# EasyEDA Pro project ProPrj_初级项目_2026-01-11.epro, schematic Schematic1

## Sheets
1 信号: Board Name: Board1; Create Date: 2025-09-25; Page Name: 信号; Project Name: 初级项目; Schematic Name: Schematic1; Update Date: 2025-11-07; Company: 嘉立创EDA; Page Size: A4; Version: V1.0
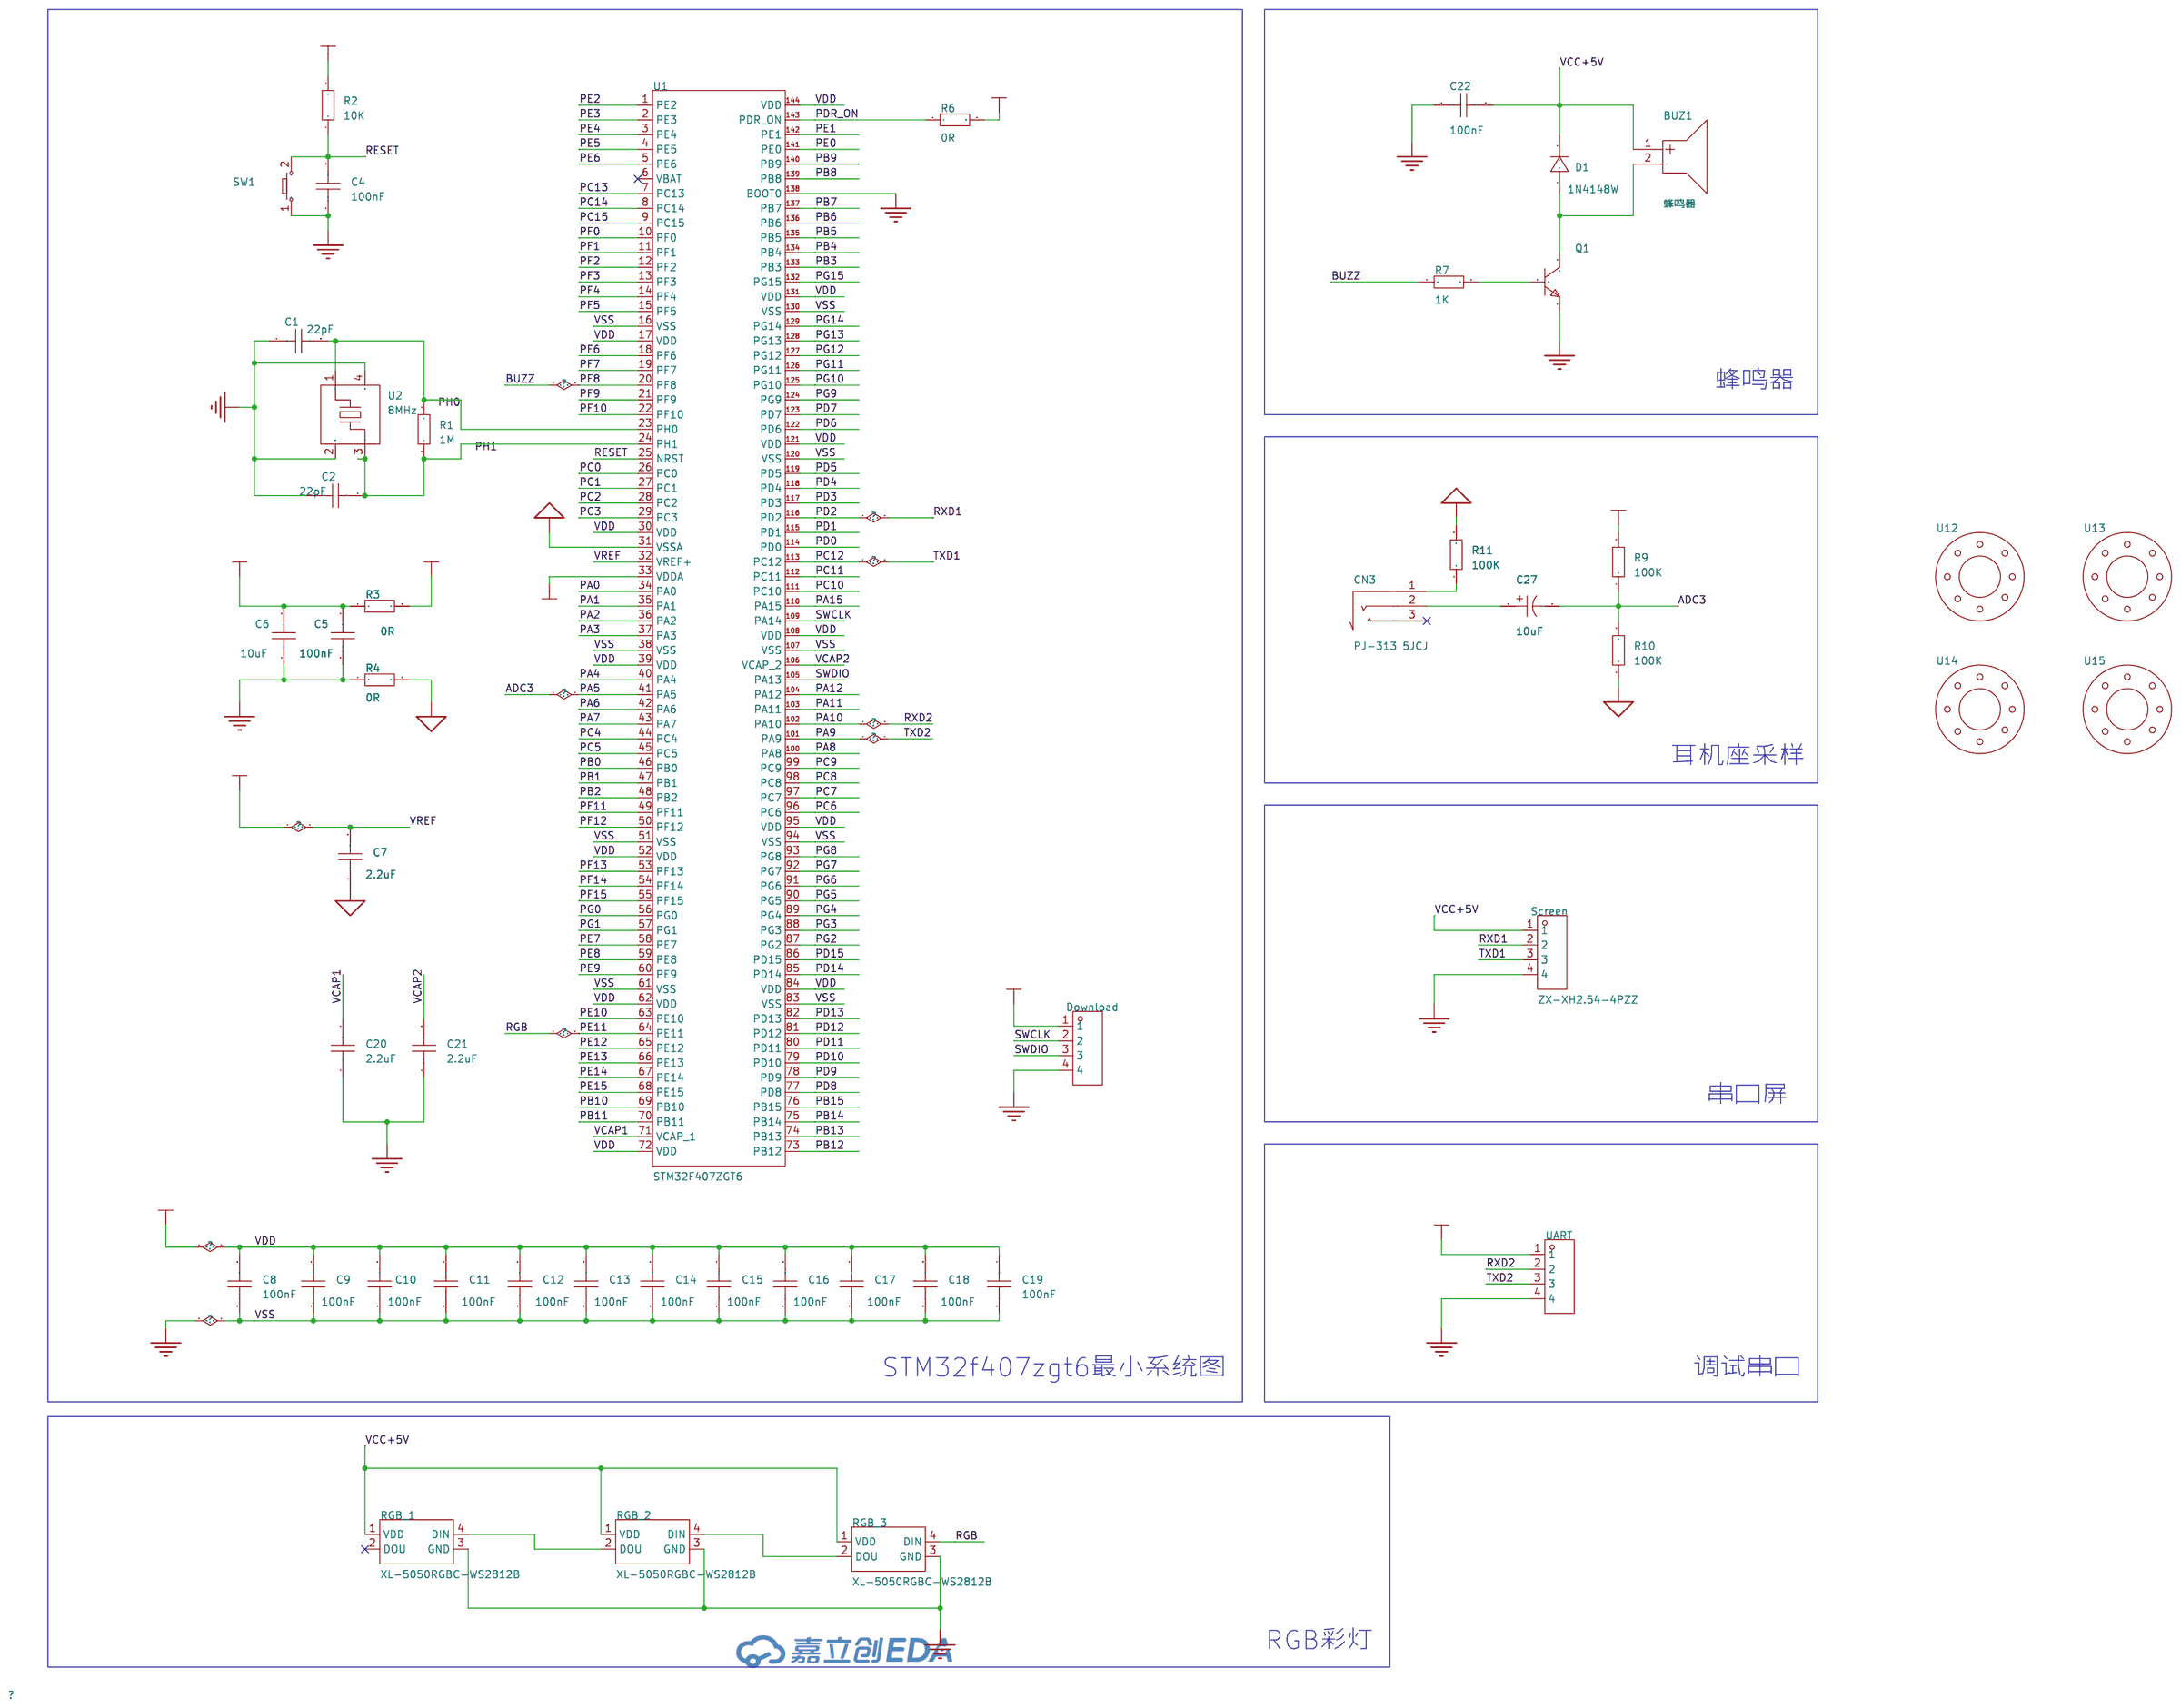
[diagram p0: 信号]
2 电源: Page Name: 电源; Update Date: 2025-09-27
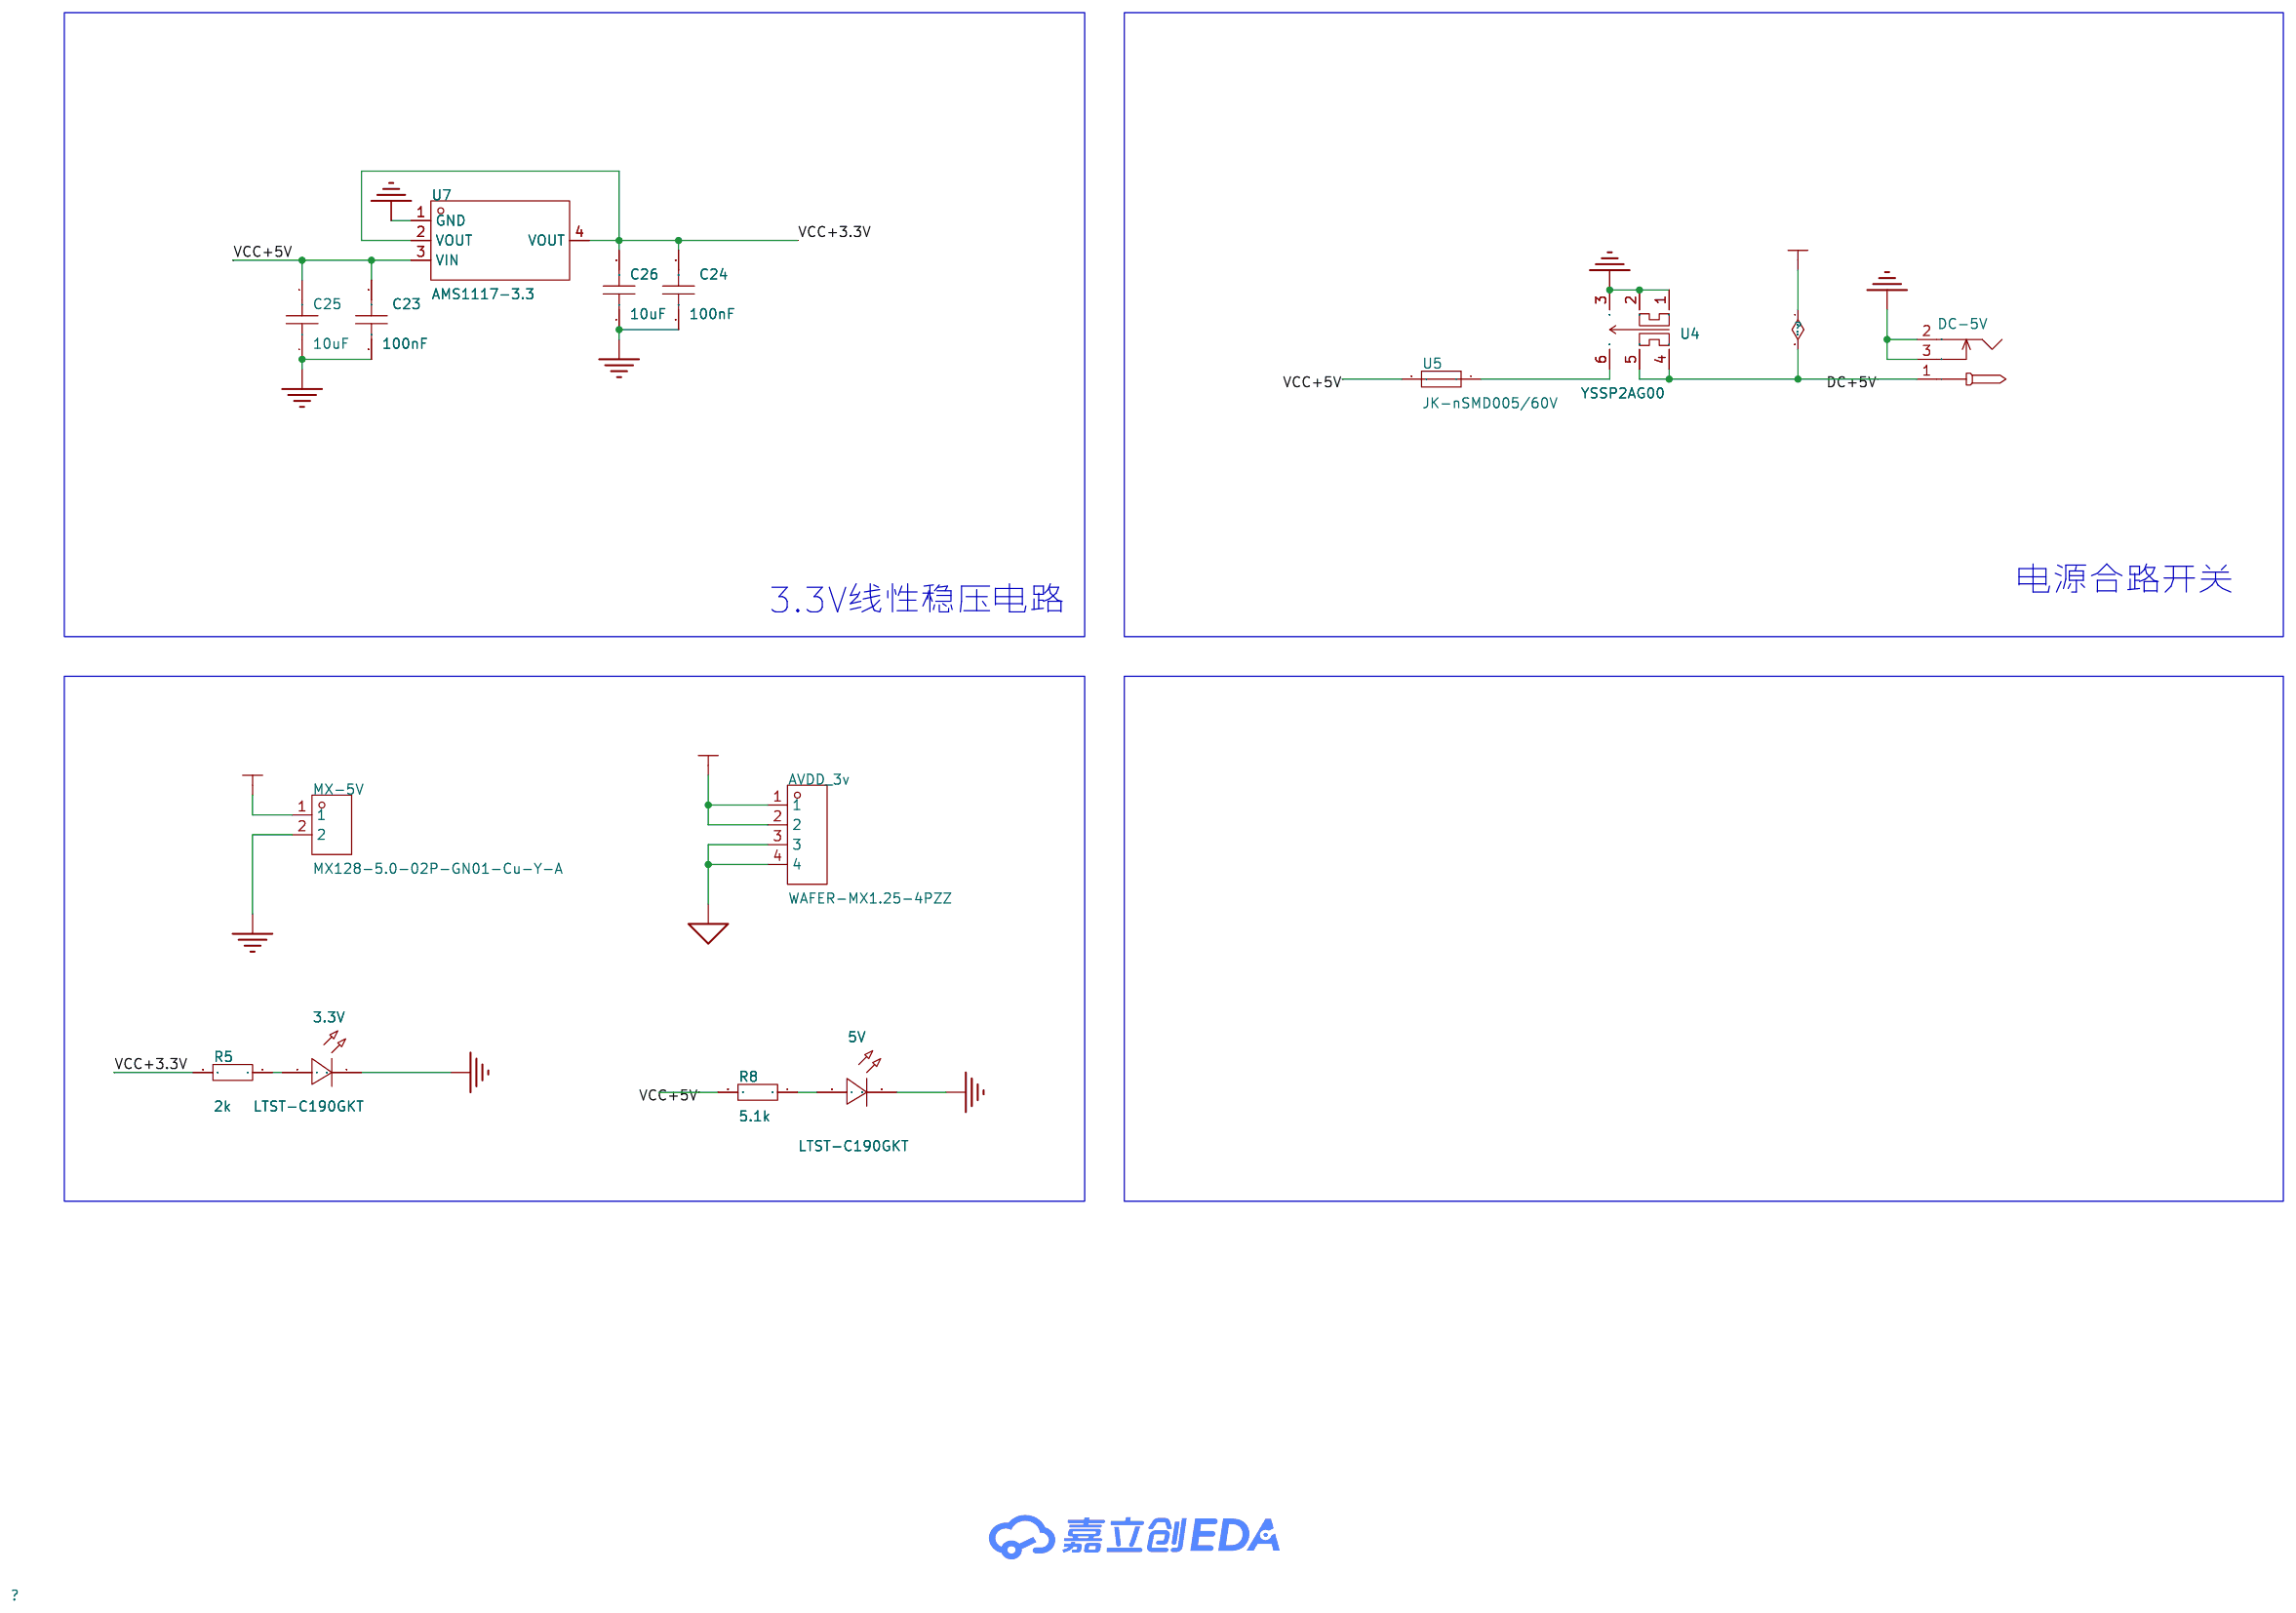
[diagram p1: 电源]

## Parts
sheet 信号
BUZ1  蜂鸣器  [BUZ-TH_BD9.0-P5.00-D0.6-FD]
C1  22pF  [C0603]
C2  22pF  [C0603]
C4  100nF  [C0805]
C5  100nF  [C0805]
C6  10uF  [C0805]
C7  2.2uF  [C0805]
C8  100nF  [C0603]
C9  100nF  [C0603]
C10  100nF  [C0603]
C11  100nF  [C0603]
C12  100nF  [C0603]
C13  100nF  [C0603]
C14  100nF  [C0603]
C15  100nF  [C0603]
C16  100nF  [C0603]
C17  100nF  [C0603]
C18  100nF  [C0603]
C19  100nF  [C0603]
C20  2.2uF  [C0603]
C21  2.2uF  [C0603]
C22  100nF  [C0805]
C27  10uF  [CAP-SMD_BD4.0-L4.3-W4.3-FD]
CN3  PJ-313 5JCJ  [AUDIO-TH_PJ-313_5JCJ]
D1  1N4148W  [SOD-123F_L2.7-W1.6-LS3.8-RD]
Download  -  [HDR-TH_4P-P2.54-V-F]
Q1  -  [S8050_SOT-23]
R1  1M  [R0603]
R2  10K  [R0805]
R3  0R  [R0805]
R4  0R  [R0805]
R6  0R  [R0805]
R7  1K  [R0805]
R9  100K  [R0805]
R10  100K  [R0805]
R11  100K  [R0805]
RGB_1  XL-5050RGBC-WS2812B  [LED-SMD_4P-L5.0-W5.0-BL_XL-5050RGBC]
RGB_2  XL-5050RGBC-WS2812B  [LED-SMD_4P-L5.0-W5.0-BL_XL-5050RGBC]
RGB_3  XL-5050RGBC-WS2812B  [LED-SMD_4P-L5.0-W5.0-BL_XL-5050RGBC]
Screen  ZX-XH2.54-4PZZ  [CONN-TH_4P-P2.50_4PIN]
SW1  -  [Key_SMD_3x4x2]
U1  STM32F407ZGT6  [LQFP-144_L20.0-W20.0-P0.50-LS22.0-BL]
U2  8MHz  [CRYSTAL-SMD_4P-L3.2-W2.5-BL]
U12  -  [固定孔]
U13  -  [固定孔]
U14  -  [固定孔]
U15  -  [固定孔]
UART  -  [HDR-TH_4P-P2.54-V-F]
sheet 电源
3.3V  LTST-C190GKT  [LED0603-RD]
5V  LTST-C190GKT  [LED0603-RD]
AVDD_3v  WAFER-MX1.25-4PZZ  [CONN-TH_4P-P1.25_WAFER-MX1.25-4PZZ]
C23  100nF  [C0805]
C24  100nF  [C0805]
C25  10uF  [C0805]
C26  10uF  [C0805]
DC-5V  -  [DC-005_2.5]
MX-5V  MX128-5.0-02P-GN01-Cu-Y-A  [CONN-TH_2P-P5.00_MX128-5.0-02P-GN01-CU-Y-A]
R5  2k  [R0805]
R8  5.1k  [R0805]
U4  YSSP2AG00  [SW-SMD_YSSP2AG00]
U5  JK-nSMD005/60V  [F1206]
U7  AMS1117-3.3  [SOT-223-3_L6.5-W3.4-P2.30-LS7.0-BR]

## Library data of the parts
BUZ1 = 蜂鸣器: Supplier Part: C9900020875; Supplier Footprint: 插件; JLCPCB Part Class: 扩展库; Supplier: LCSC
C1 C2 C8-C21 = CAP_0603: Supplier Footprint: 0603
C4-C7 C22 = CAP_0805: Supplier Footprint: 0805
C27 = JVJ35V10M4x5: 容值:10uF;精度:±20%;额定电压:35V;纹波电流:14mA@120Hz;; LCSC Part Name: 10uF ±20% 35V; Supplier Part: C46550410; Manufacturer: JIERR(捷而瑞); Supplier Footprint: SMD,D4xL5.4mm; JLCPCB Part Class: 扩展库; Datasheet: https://item.szlcsc.com/datasheet/JVJ35V10M4x5/48680104.html; Supplier: LCSC; Tolerance: ±20%; Voltage Rating: 35V; Ripple Current: 14mA@120Hz; Diameter: 4mm; Height - Seated (Max): 5.4mm; Lifetime: 2000hrs@105℃; Operating Temperature: -55℃~+105℃
CN3 = PJ-313 5JCJ: 连接器类型:3.5mm耳机座;额定电流:500mA;额定电压:30V;触头材质:-;触头镀层:银;工作温度:-20℃~+70℃;; LCSC Part Name: 3.5mm耳机座; Supplier Part: C668607; Manufacturer: SHOU HAN(首韩); Supplier Footprint: 插件; JLCPCB Part Class: 扩展库; Datasheet: https://item.szlcsc.com/datasheet/PJ-313%25205JCJ/698550.html; Supplier: LCSC; Connector Type: 3.5mm耳机座; Current Rating: 500mA; Voltage Rating (Max): 30V; Contact Plating: 银; Operating Temperature: -20℃~+70℃
D1 = 1N4148W_C81598: 二极管配置:独立式;正向压降(Vf):1V@50mA;直流反向耐压(Vr):75V;整流电流:150mA;反向恢复时间(Trr):4ns;; Supplier Part: C81598; Manufacturer: ST(先科); Supplier Footprint: SOD-123; JLCPCB Part Class: 基础库; Datasheet: https://item.szlcsc.com/datasheet/1N4148W/82750.html; Supplier: LCSC; Diode Configuration: 独立式; Voltage - Forward(Vf@If): 1V@50mA; Voltage - DC Reverse(Vr): 75V; Current - Rectified: 150mA; Pd - Power Dissipation: 400mW; Reverse Leakage Current (Ir): 1uA@75V; Reverse Recovery Time (trr): 4ns; Non-Repetitive Peak Forward Surge Current: 1A
Download UART = HDR-F_2.54_1x4P: Supplier Part: C2718488; Supplier Footprint: 插件
Q1 = S8050_SOT_NPN: Supplier Footprint: SOT-23
R1 R9-R11 = Res_0603: Supplier Footprint: 0603
R2-R4 R6 R7 = Res_0805: Supplier Footprint: 0805
RGB_1-RGB_3 = XL-5050RGBC-WS2812B: 120°; Supplier Part: C2843785; Manufacturer: XINGLIGHT(成兴光); Supplier Footprint: SMD5050-4P; JLCPCB Part Class: 扩展库; Datasheet: https://item.szlcsc.com/datasheet/XL-5050RGBC-WS2812B/3033136.html; Supplier: LCSC; Wavelength: 465nm~475nm；620nm~635nm；520nm~535nm; Luminous Intensity: R:500mcd~700mcd；B:300mcd~500mcd；G:1300mcd~1800mcd; Fixed-Frequency Pwm Mode: 4kHz; Data Transmission Rate: 800Kbit/s; Voltage - Supply: 3.5V~5.5V; Quiescent Current: 0.3mA; Lens Color: 无色透明透镜; ESD Withstand Voltage: 2000V; Installation method: 正贴; Operating Temperature: -20℃~+85℃; Viewing Angle: 120°; Length: 5mm; Width: 1.6mm; Height: 5mm
Screen = ZX-XH2.54-4PZZ: 插针结构:1x4P;间距:2.5mm;安装方式:直插;参考系列:XH;总PIN数:4P;排数:1;每排PIN数:4;行距:-;额定电流:3A;触头材质:黄铜;触头镀层:锡;工作温度:-25℃~+85℃;; LCSC Part Name: 1x4P 间距:2.5mm 直插 系列:XH; Supplier Part: C7429634; Manufacturer: Megastar(兆星); Supplier Footprint: 插件,P=2.5mm; JLCPCB Part Class: 扩展库; Datasheet: https://item.szlcsc.com/datasheet/ZX-XH2.54-4PZZ/8427551.html; Supplier: LCSC; Pins Structure: 1x4P; Pitch: 2.5mm; Mounting Type: 直插; Reference Series: XH; Number of Pins: 4P; Number of Rows: 1; Number of PINs Per Row: 4; Current Rating: 3A; Contact Material: 黄铜; Contact Plating: 锡; Operating Temperature: -25℃~+85℃; Voltage Rating: 250V; Plastic Material: PA66; Flame Retardant Rating: UL94V-0; Color: 白色; Z-Height of the Board: 7mm; X-Length of Bottom Edge on Board (Spacing Line): 12.5mm; Y-Width of Bottom Edge on Board: 5.9mm
SW1 = Key_SMD_3x4x2: Supplier Footprint: SMD
U1 = STM32F407ZGT6: CPU内核:ARM-M4;CPU最大主频:168MHz;应用领域:-;; LCSC Part Name: 带DSP和FPU的高性能基础系列ARM Cortex-M4 MCU，具有1 MB Flash、168 MHz CPU、ART加速器、以太网和FSMC; Supplier Part: C19156; Manufacturer: ST(意法半导体); Supplier Footprint: LQFP-144(20x20); JLCPCB Part Class: 扩展库; Datasheet: https://item.szlcsc.com/datasheet/STM32F407ZGT6/19860.html; Supplier: LCSC; CPU Core: ARM-M4; CPU Maximum Speed: 168MHz; Program Storage Size: 1MB; Program Memory Type: FLASH; Number of I/O: 114; ADC (Bit): 12bit; DAC (Bit): 12bit; Voltage - Supply: 1.8V~3.6V
U2 = XL2SI-111-8M: 晶振类型:贴片晶振;频率:8MHz;常温频差:±10ppm;负载电容:20pF;频率稳定度:±20ppm;; LCSC Part Name: YSX321SL 8MHZ 4P 3225 20PF ±10PPM -40~85℃ (±20PPM); Supplier Part: C20563844; Manufacturer: YXC(扬兴晶振); Supplier Footprint: SMD3225-4P; JLCPCB Part Class: 扩展库; Datasheet: https://item.szlcsc.com/datasheet/XL2SI-111-8M/21903319.html; Supplier: LCSC; Type: 贴片晶振; Normal temperature Frequency Tolerance: ±10ppm; Load Capacitance: 20pF; Frequency Stability: ±20ppm; Operating Temperature: -40℃~+85℃
U12-U15 = 固定孔
3.3V 5V = LTST-C190GKT: 发光颜色:黄绿色;正向电压(VF):2.1V;功率:100mW;正向电流:20mA;主波长:569nm;二极管配置:-;透镜颜色:无色透明透镜;色温:-;发光强度:6mcd;发光角度:130°;载带方式:-;工作温度:-55℃~+85℃;; LCSC Part Name: 普绿/黄绿; Supplier Part: C125093; Manufacturer: LITEON(光宝); Supplier Footprint: 0603; JLCPCB Part Class: Extended Part; Datasheet: https://atta.szlcsc.com/upload/public/pdf/source/20180326/C125093_24EC4C6D214E1CE2A6C2F0B82DCA7C02.pdf; Supplier: LCSC; Emitted Color: 黄绿色; Forward Voltage (VF): 2.1V; Power Dissipation: 100mW; Forward Current: 20mA; Dominant Wavelength: 569nm; Peak Wavelength: 565nm; Lens Color: 无色透明透镜; Luminous Intensity: 6mcd; Viewing Angle: 130°; Operating Temperature: -55℃~+85℃
AVDD_3v = WAFER-MX1.25-4PZZ: 插针结构:1x4P;间距:1.25mm;安装方式:直插;参考系列:PicoBlade(MX 1.25);总PIN数:4P;排数:1;每排PIN数:4;行距:-;额定电流:1A;触头材质:黄铜;触头镀层:锡;工作温度:-25℃~+85℃;; LCSC Part Name: 1x4P 间距:1.25mm 直插 系列:PicoBlade(MX 1.25); Supplier Part: C3029397; Manufacturer: XUNPU(讯普); Supplier Footprint: 插件,P=1.25mm; JLCPCB Part Class: 扩展库; Datasheet: https://item.szlcsc.com/datasheet/WAFER-MX1.25-4PZZ/3561409.html; Supplier: LCSC; Pins Structure: 1x4P; Pitch: 1.25mm; Mounting Type: 直插; Reference Series: PicoBlade(MX 1.25); Number of Pins: 4P; Number of Rows: 1; Number of PINs Per Row: 4; Current Rating: 1A; Contact Material: 黄铜; Contact Plating: 锡; Operating Temperature: -25℃~+85℃; Voltage Rating: 125V; Plastic Material: LCP; Flame Retardant Rating: UL94V-0; Color: 米色; Z-Height of the Board: 4.6mm; X-Length of Bottom Edge on Board (Spacing Line): 6.9mm; Y-Width of Bottom Edge on Board: 3.3mm
C23 C24 = CC0805KRX7R9BB104: 容值:100nF;精度:±10%;额定电压:50V;材质(温度系数):X7R;; LCSC Part Name: 100nF ±10% 50V; Supplier Part: C49678; Manufacturer: YAGEO(国巨); Supplier Footprint: 0805; JLCPCB Part Class: Basic Part; Datasheet: https://atta.szlcsc.com/upload/public/pdf/source/20180224/C181747_15194369449651363981.pdf; Supplier: LCSC; Tolerance: ±10%; Voltage Rated: 50V; Temperature Coefficient: X7R
C25 C26 = CL21A106KAYNNNE_C15850: 容值:10uF;精度:±10%;额定电压:25V;材质(温度系数):X5R;; LCSC Part Name: 10uF ±10% 25V; Supplier Part: C15850; Manufacturer: SAMSUNG(三星); Manufacturer Part: CL21A106KAYNNNE; Supplier Footprint: 0805; JLCPCB Part Class: Basic Part; Datasheet: https://atta.szlcsc.com/upload/public/pdf/source/20160218/1457707763339.pdf; Supplier: LCSC; Tolerance: ±10%; Voltage Rated: 25V; Temperature Coefficient: X5R
DC-5V = DC-005_2.5: Supplier Footprint: 插件
MX-5V = MX128-5.0-02P-GN01-Cu-Y-A: 结构:1x2P;间距:5mm;颜色:绿色;安装方式:直插;排数:1;每排PIN数:2;额定电流:10A;额定电压:300V;线规 - AWG:12~24;线规 - 平方毫米:2.5;工作温度范围:-40℃~+105℃;; LCSC Part Name: 1x2P 5mm 直插 排数:1 每排P数:2; Supplier Part: C5188463; Manufacturer: MAX(迈旭); Supplier Footprint: 插件,P=5mm; JLCPCB Part Class: 扩展库; Datasheet: https://atta.szlcsc.com/upload/public/pdf/source/20230914/7C59C50CB6A87747FF89F939B009DABF.pdf; Supplier: LCSC; Structure: 1x2P; Pitch: 5mm; Color: 绿色; Mounting Style: 直插; Number of Pins: 2P; Number of Rows: 1; Number of PINs Per Row: 2; Screw Specification: M2.5; Current Rating (Max): 10A; Voltage Rating (Max): 300V; Wire Gauge - AWG: 12~24; Wire Gauge - mm2: 2.5; Operating Temperature Range: -40℃~+105℃
R5 R8 = 0805W8F2001T5E: 电阻类型:厚膜电阻;阻值:2kΩ;精度:±1%;功率:125mW;最大工作电压:150V;温度系数:±100ppm/℃;; LCSC Part Name: 2kΩ ±1% 125mW 厚膜电阻; Supplier Part: C17604; Manufacturer: UNI-ROYAL(厚声); Supplier Footprint: 0805; JLCPCB Part Class: Basic Part; Datasheet: https://atta.szlcsc.com/upload/public/pdf/source/20200306/C422600_1E6D84923E4A46A82E41ADD87F860B5C.pdf; Supplier: LCSC; Type: 厚膜电阻; Tolerance: ±1%; Power(Watts): 125mW; Overload Voltage (Max): 150V; Temperature Coefficient: ±100ppm/℃; Operating Temperature Range: -55℃~+155℃
U4 = YSSP2AG00: LCSC Part Name: 9x3.6 正按6脚贴片滑动开关; Supplier Part: C5188558; Manufacturer: YIYUAN(怡远); Supplier Footprint: SMD; JLCPCB Part Class: 扩展库; Datasheet: https://atta.szlcsc.com/upload/public/pdf/source/20221011/AF6FF47B5A85181594B051FD518E9363.pdf; Supplier: LCSC
U5 = JK-nSMD005/60V: 最大电压:60V;最大电流:100A;保持电流:50mA;跳闸电流:150mA;; LCSC Part Name: 60V 0.05A 1206自恢复; Supplier Part: C2830235; Manufacturer: JK(金科); Supplier Footprint: 1206; JLCPCB Part Class: 扩展库; Datasheet: https://atta.szlcsc.com/upload/public/pdf/source/20210427/C2830251_B9511B640A50AD6A91174E2DDDD254CA.pdf; Supplier: LCSC; Operating Voltage (Max): 60V; Current Rating (Max): 100A; Hold Current: 50mA; Trip Current: 150mA; Resistance - Initial (Ri) (Min): 3.6Ω; Resistance - Post Trip (R1) (Max): 50Ω; Maximum Time to Trip: 1.5s; Operating Temperature: -40℃~+85℃
U7 = AMS1117-3.3_C6186: 输出类型:固定;最大输入电压:-;输出电压:3.3V;最大输出电流:1A;电源纹波抑制比(PSRR):72dB@(120Hz);输出极性:正极;; LCSC Part Name: 输出3.3V 1A; Supplier Part: C6186; Manufacturer: AMS; Supplier Footprint: SOT-223; JLCPCB Part Class: 基础库; Datasheet: https://atta.szlcsc.com/upload/public/pdf/source/20180727/C6186_7A095716F0823C02F1997A905E26C086.pdf; Supplier: LCSC; Output Type: 固定; Output Voltage: 3.3V; MAX Output Current: 1A; Power Supply Rejection Ratio (PSRR): 72dB@(120Hz); Dropout Voltage: 1.3V@(800mA); Output Polarity: 正极; Number of Outputs: 1

## Nets
AGND: AVDD_3v.3 AVDD_3v.4 C7.1 R4.2 R10.1 R11.2 U1.31(VSSA)
GND: 3.3V.1(C) 5V.1(C) C1.1 C2.1 C4.1 C5.1 C6.1 C8.1 C9.1 C10.1 C11.1 C12.1 C13.1 C14.1 C15.1 C16.1 C17.1 C18.1 C19.1 C20.1 C21.1 C22.1 C23.1 C24.1 C25.1 C26.1 DC-5V.2 DC-5V.3 Download.4 MX-5V.2 Q1.2 R4.1 RGB_1.3(GND) RGB_2.3(GND) RGB_3.3(GND) Screen.4 SW1.1 U1.16(VSS) U1.38(VSS) U1.51(VSS) U1.61(VSS) U1.83(VSS) U1.94(VSS) U1.107(VSS) U1.120(VSS) U1.130(VSS) U1.138(BOOT0) U2.2(GND) U2.4(GND) U4.1 U4.2 U4.3 U7.1(GND) UART.4
VCC+3.3V: C5.2 C6.2 C8.2 C9.2 C10.2 C11.2 C12.2 C13.2 C14.2 C15.2 C16.2 C17.2 C18.2 C19.2 C24.2 C26.2 Download.1 R2.2 R3.1 R5.2 R6.2 U1.17(VDD) U1.30(VDD) U1.39(VDD) U1.52(VDD) U1.62(VDD) U1.72(VDD) U1.84(VDD) U1.95(VDD) U1.108(VDD) U1.121(VDD) U1.131(VDD) U1.144(VDD) U7.2(VOUT) U7.4(VOUT) UART.1
VCC+5V: BUZ1.1(+) C22.2 C23.2 C25.2 D1.1(K) R8.2 RGB_1.1(VDD) RGB_2.1(VDD) RGB_3.1(VDD) Screen.1 U5.2 U7.3(VIN)
VDDA: AVDD_3v.1 AVDD_3v.2 C7.2 R3.2 R9.2 U1.32(VREF+) U1.33(VDDA)
ADC3: C27.2 R9.1 R10.2 U1.41(PA5)
BUZZ: R7.1 U1.20(PF8)
MX+5V: DC-5V.1(4) MX-5V.1 U4.4 U4.5
PA0: U1.34(PA0)
PA1: U1.35(PA1)
PA2: U1.36(PA2)
PA3: U1.37(PA3)
PA4: U1.40(PA4)
PA6: U1.42(PA6)
PA7: U1.43(PA7)
PA8: U1.100(PA8)
PA9: U1.101(PA9) UART.3
PA10: U1.102(PA10) UART.2
PA11: U1.103(PA11)
PA12: U1.104(PA12)
PA15: U1.110(PA15)
PB0: U1.46(PB0)
PB1: U1.47(PB1)
PB2: U1.48(PB2)
PB3: U1.133(PB3)
PB4: U1.134(PB4)
PB5: U1.135(PB5)
PB6: U1.136(PB6)
PB7: U1.137(PB7)
PB8: U1.139(PB8)
PB9: U1.140(PB9)
PB10: U1.69(PB10)
PB11: U1.70(PB11)
PB12: U1.73(PB12)
PB13: U1.74(PB13)
PB14: U1.75(PB14)
PB15: U1.76(PB15)
PC0: U1.26(PC0)
PC1: U1.27(PC1)
PC2: U1.28(PC2)
PC3: U1.29(PC3)
PC4: U1.44(PC4)
PC5: U1.45(PC5)
PC6: U1.96(PC6)
PC7: U1.97(PC7)
PC8: U1.98(PC8)
PC9: U1.99(PC9)
PC10: U1.111(PC10)
PC11: U1.112(PC11)
PC12: Screen.3 U1.113(PC12)
PC13: U1.7(PC13)
PC14: U1.8(PC14)
PC15: U1.9(PC15)
PD0: U1.114(PD0)
PD1: U1.115(PD1)
PD2: Screen.2 U1.116(PD2)
PD3: U1.117(PD3)
PD4: U1.118(PD4)
PD5: U1.119(PD5)
PD6: U1.122(PD6)
PD7: U1.123(PD7)
PD8: U1.77(PD8)
PD9: U1.78(PD9)
PD10: U1.79(PD10)
PD11: U1.80(PD11)
PD12: U1.81(PD12)
PD13: U1.82(PD13)
PD14: U1.85(PD14)
PD15: U1.86(PD15)
PDR_ON: R6.1 U1.143(PDR_ON)
PE0: U1.141(PE0)
PE1: U1.142(PE1)
PE2: U1.1(PE2)
PE3: U1.2(PE3)
PE4: U1.3(PE4)
PE5: U1.4(PE5)
PE6: U1.5(PE6)
PE7: U1.58(PE7)
PE8: U1.59(PE8)
PE9: U1.60(PE9)
PE10: U1.63(PE10)
PE11: RGB_3.4(DIN) U1.64(PE11)
PE12: U1.65(PE12)
PE13: U1.66(PE13)
PE14: U1.67(PE14)
PE15: U1.68(PE15)
PF0: U1.10(PF0)
PF1: U1.11(PF1)
PF2: U1.12(PF2)
PF3: U1.13(PF3)
PF4: U1.14(PF4)
PF5: U1.15(PF5)
PF6: U1.18(PF6)
PF7: U1.19(PF7)
PF9: U1.21(PF9)
PF10: U1.22(PF10)
PF11: U1.49(PF11)
PF12: U1.50(PF12)
PF13: U1.53(PF13)
PF14: U1.54(PF14)
PF15: U1.55(PF15)
PG0: U1.56(PG0)
PG1: U1.57(PG1)
PG2: U1.87(PG2)
PG3: U1.88(PG3)
PG4: U1.89(PG4)
PG5: U1.90(PG5)
PG6: U1.91(PG6)
PG7: U1.92(PG7)
PG8: U1.93(PG8)
PG9: U1.124(PG9)
PG10: U1.125(PG10)
PG11: U1.126(PG11)
PG12: U1.127(PG12)
PG13: U1.128(PG13)
PG14: U1.129(PG14)
PG15: U1.132(PG15)
PH0: C1.2 R1.2 U1.23(PH0) U2.1
PH1: C2.2 R1.1 U1.24(PH1) U2.3
RESET: C4.2 R2.1 SW1.2 U1.25(NRST)
SWCLK: Download.2 U1.109(PA14)
SWDIO: Download.3 U1.105(PA13)
VCAP1: C20.2 U1.71(VCAP_1)
VCAP2: C21.2 U1.106(VCAP_2)
$1N3648: BUZ1.2(-) D1.2(A) Q1.3
$1N3672: Q1.1 R7.2
$1N5975: CN3.1 R11.1
$1N6999: RGB_1.4(DIN) RGB_2.2(DOU)
$1N7002: RGB_2.4(DIN) RGB_3.2(DOU)
$1N9505: C27.1 CN3.2
$2N3532: U4.6 U5.1
$2N3690: 3.3V.2(A) R5.1
$2N3701: 5V.2(A) R8.1

Not connected (* = marked no-connect by the designer): CN3 3*; RGB_1 2(DOU)*; U1 6(VBAT)*

## Notes on the sheets
sheet 1
- 蜂鸣器
- 耳机座采样
- 串口屏
- STM32f407zgt6最小系统图
- 调试串口
- RGB彩灯
sheet 2
- 电源合路开关
- 3.3V线性稳压电路
